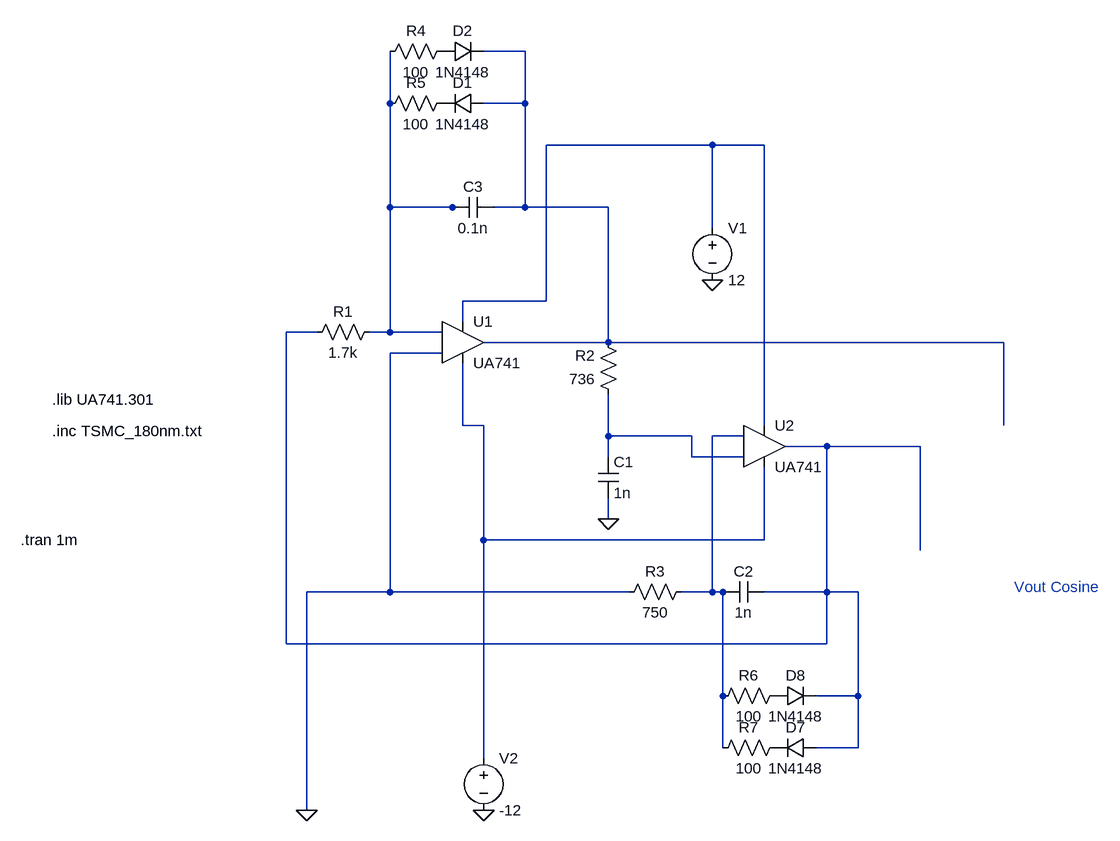
[diagram p0: schematic oscillator.asc]
oscillator.asc, the LTspice schematic file:
Version 4.1
SHEET 1 1256 680
WIRE 144 -560 80 -560
WIRE -64 -480 -64 -560
WIRE 144 -480 144 -560
WIRE 144 -480 80 -480
WIRE 432 -416 176 -416
WIRE 512 -416 432 -416
WIRE -64 -320 -64 -480
WIRE 32 -320 -64 -320
WIRE 48 -320 32 -320
WIRE 144 -320 144 -480
WIRE 144 -320 96 -320
WIRE 272 -320 144 -320
WIRE 432 -288 432 -416
WIRE 176 -176 176 -416
WIRE 176 -176 48 -176
WIRE 48 -144 48 -176
WIRE -176 -128 -224 -128
WIRE -64 -128 -64 -320
WIRE -64 -128 -96 -128
WIRE 16 -128 -64 -128
WIRE 272 -112 272 -320
WIRE 272 -112 80 -112
WIRE 880 -112 272 -112
WIRE 16 -96 -64 -96
WIRE 48 16 48 -80
WIRE 80 16 48 16
WIRE 512 16 512 -416
WIRE 880 16 880 -112
WIRE 272 32 272 -32
WIRE 400 32 272 32
WIRE 480 32 432 32
WIRE 608 48 544 48
WIRE 752 48 608 48
WIRE 272 64 272 32
WIRE 400 64 400 32
WIRE 480 64 400 64
WIRE 272 160 272 128
WIRE 80 192 80 16
WIRE 512 192 512 80
WIRE 512 192 80 192
WIRE 752 208 752 48
WIRE -64 272 -64 -96
WIRE -64 272 -192 272
WIRE 304 272 -64 272
WIRE 432 272 432 32
WIRE 432 272 384 272
WIRE 448 272 432 272
WIRE 608 272 608 48
WIRE 608 272 512 272
WIRE 656 272 608 272
WIRE -224 352 -224 -128
WIRE 608 352 608 272
WIRE 608 352 -224 352
WIRE 448 432 448 272
WIRE 656 432 656 272
WIRE 656 432 592 432
WIRE 448 512 448 432
WIRE 656 512 656 432
WIRE 656 512 592 512
WIRE 80 528 80 192
WIRE -192 608 -192 272
FLAG 272 160 0
FLAG 432 -208 0
FLAG -192 608 0
FLAG 80 608 0
SYMBOL UA741 48 -176 R0
SYMATTR InstName U1
SYMBOL UA741 512 -16 R0
SYMATTR InstName U2
SYMBOL res -80 -144 R90
WINDOW 0 0 56 VBottom 2
WINDOW 3 32 56 VTop 2
SYMATTR InstName R1
SYMATTR Value 1.7k
SYMBOL res 288 -16 R180
WINDOW 0 36 76 Left 2
WINDOW 3 36 40 Left 2
SYMATTR InstName R2
SYMATTR Value 736
SYMBOL cap 256 64 R0
SYMATTR InstName C1
SYMATTR Value 1n
SYMBOL res 400 256 R90
WINDOW 0 0 56 VBottom 2
WINDOW 3 32 56 VTop 2
SYMATTR InstName R3
SYMATTR Value 750
SYMBOL cap 512 256 R90
WINDOW 0 0 32 VBottom 2
WINDOW 3 32 32 VTop 2
SYMATTR InstName C2
SYMATTR Value 1n
SYMBOL cap 96 -336 R90
WINDOW 0 0 32 VBottom 2
WINDOW 3 32 32 VTop 2
SYMATTR InstName C3
SYMATTR Value 0.1n
SYMBOL voltage 432 -304 R0
WINDOW 123 0 0 Left 0
WINDOW 39 0 0 Left 0
SYMATTR InstName V1
SYMATTR Value 12
SYMBOL voltage 80 512 R0
WINDOW 123 0 0 Left 0
WINDOW 39 0 0 Left 0
SYMATTR InstName V2
SYMATTR Value -12
SYMBOL diode 80 -496 R90
WINDOW 0 0 32 VBottom 2
WINDOW 3 32 32 VTop 2
SYMATTR InstName D1
SYMATTR Value 1N4148
SYMBOL diode 16 -544 R270
WINDOW 0 32 32 VTop 2
WINDOW 3 0 32 VBottom 2
SYMATTR InstName D2
SYMATTR Value 1N4148
SYMBOL diode 592 496 R90
WINDOW 0 0 32 VBottom 2
WINDOW 3 32 32 VTop 2
SYMATTR InstName D7
SYMATTR Value 1N4148
SYMBOL diode 528 448 R270
WINDOW 0 32 32 VTop 2
WINDOW 3 0 32 VBottom 2
SYMATTR InstName D8
SYMATTR Value 1N4148
SYMBOL res 32 -576 R90
WINDOW 0 0 56 VBottom 2
WINDOW 3 32 56 VTop 2
SYMATTR InstName R4
SYMATTR Value 100
SYMBOL res 32 -496 R90
WINDOW 0 0 56 VBottom 2
WINDOW 3 32 56 VTop 2
SYMATTR InstName R5
SYMATTR Value 100
SYMBOL res 544 416 R90
WINDOW 0 0 56 VBottom 2
WINDOW 3 32 56 VTop 2
SYMATTR InstName R6
SYMATTR Value 100
SYMBOL res 544 496 R90
WINDOW 0 0 56 VBottom 2
WINDOW 3 32 56 VTop 2
SYMATTR InstName R7
SYMATTR Value 100
TEXT 896 264 Left 2 ;Vout Cosine
TEXT -584 24 Left 2 !.inc TSMC_180nm.txt
TEXT -584 -24 Left 2 !.lib UA741.301
TEXT -632 192 Left 2 !.tran 1m

The netlist it stands for:
* oscillator.asc
X§U1 0 N002 N003 N005 N001 UA741  ; pins In+ In- V+ V- OUT
X§U2 N006 N007 N003 N005 N004 UA741  ; pins In+ In- V+ V- OUT
R1 N002 N004 1.7k
R2 N006 N001 736
C1 N006 0 1n
R3 N007 0 750
C2 N004 N007 1n
C3 N001 N002 0.1n
V1 N003 0 12
V2 N005 0 -12
D1 N001 P001 1N4148
D2 P002 N001 1N4148
D7 N004 P003 1N4148
D8 P004 N004 1N4148
R4 P002 N002 100
R5 P001 N002 100
R6 P004 N007 100
R7 P003 N007 100
.model D D
.lib standard.dio
* Vout Cosine
.inc TSMC_180nm.txt
.lib UA741.301
.tran 1m
.backanno
.end